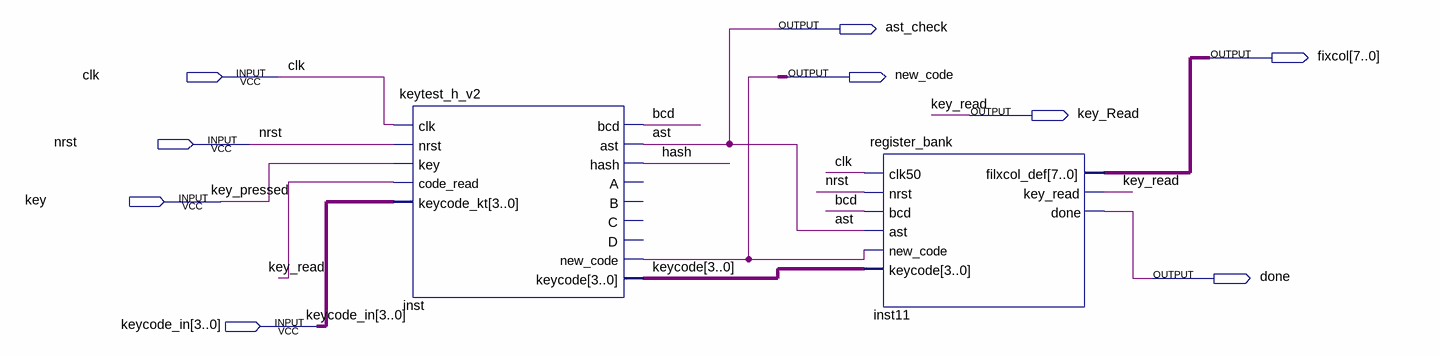
[diagram p0: schematic sheet]
// Quartus schematic register_sim.bdf as structural Verilog: 2 symbols, 9 pins
module register_sim (
  input  clk,
  input  nrst,
  input  key,
  input  [3:0] keycode_in,
  output ast_check,
  output [7:0] fixcol,
  output new_code,
  output key_Read,
  output done
);

  wire bcd, hash;
  wire [3:0] keycode;

  keytest_h_v2 inst (
    .clk(clk), .nrst(nrst), .key(key), .code_read(key_Read), .keycode_kt(keycode_in), .bcd(bcd),
    .ast(ast_check), .hash(hash), .new_code(new_code), .keycode(keycode));  // open: A, B, C, D
  register_bank inst11 (
    .clk50(clk), .nrst(nrst), .bcd(bcd), .ast(ast_check), .new_code(new_code), .keycode(keycode),
    .filxcol_def(fixcol), .key_read(key_Read), .done(done));

  // Other names for the same wires on the sheet: ast = ast_check; key_pressed = key
endmodule
